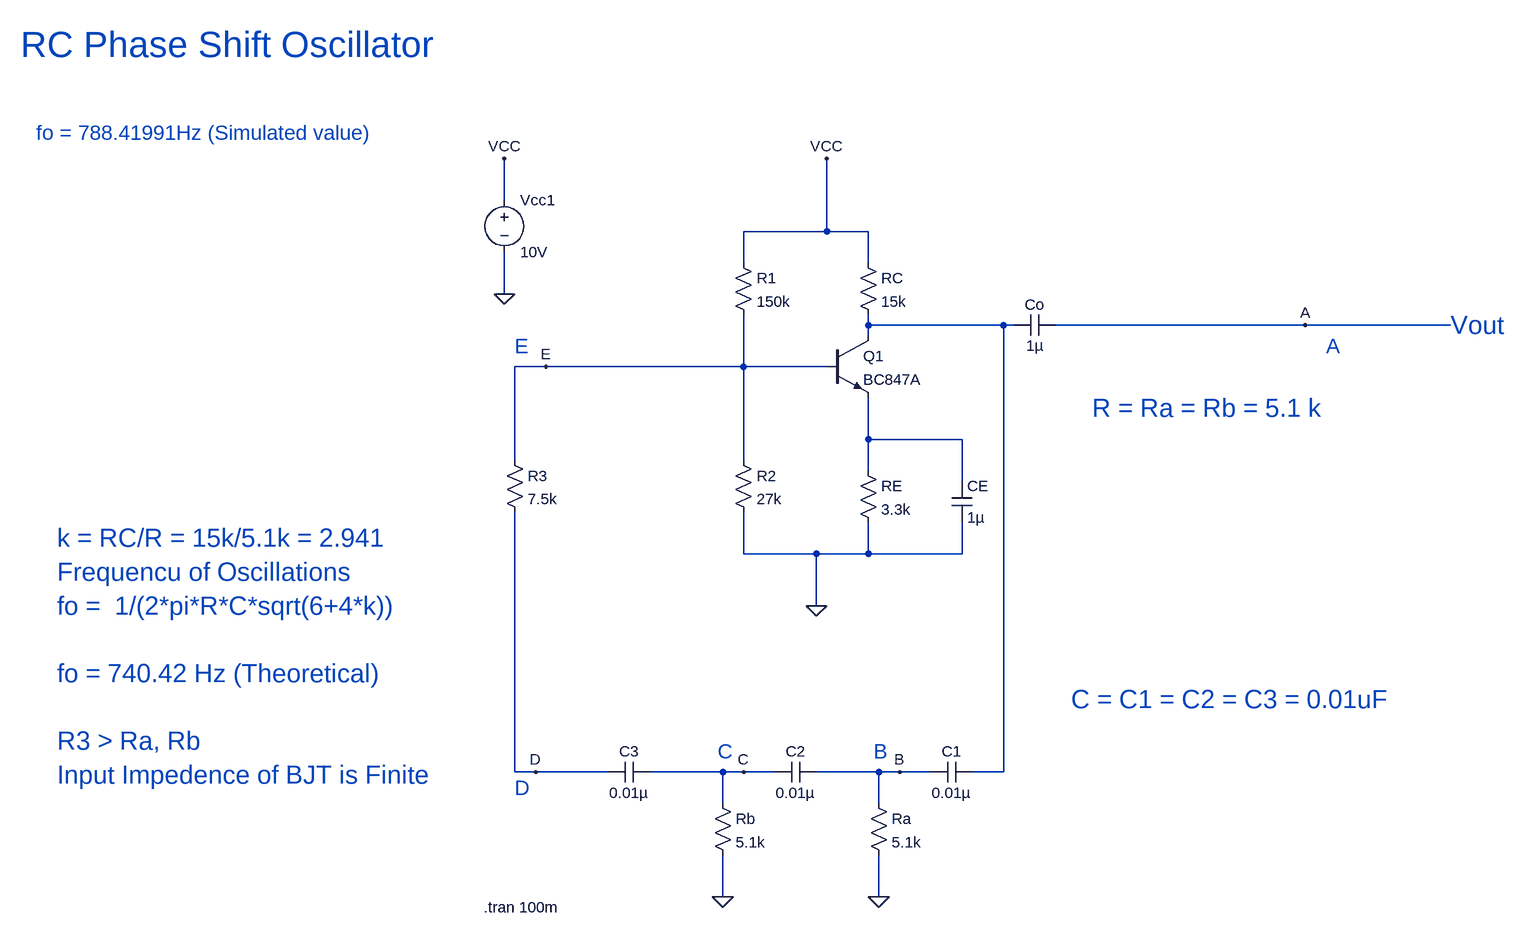
[diagram p0: schematic Phase_shift_Oscillator.asc]
Phase_shift_Oscillator.asc, the LTspice schematic file:
Version 4
SHEET 1 1012 740
WIRE -640 -368 -640 -432
WIRE -144 -320 -144 -432
WIRE -144 -320 -272 -320
WIRE -80 -320 -144 -320
WIRE -272 -272 -272 -320
WIRE -80 -272 -80 -320
WIRE -640 -224 -640 -288
WIRE -80 -176 -80 -192
WIRE 128 -176 -80 -176
WIRE 144 -176 128 -176
WIRE 592 -176 208 -176
WIRE 816 -176 592 -176
WIRE -80 -160 -80 -176
WIRE -576 -112 -624 -112
WIRE -272 -112 -272 -192
WIRE -272 -112 -576 -112
WIRE -144 -112 -272 -112
WIRE -80 0 -80 -64
WIRE 64 0 -80 0
WIRE -624 32 -624 -112
WIRE -272 32 -272 -112
WIRE -80 48 -80 0
WIRE 64 64 64 0
WIRE -272 176 -272 112
WIRE -160 176 -272 176
WIRE -80 176 -80 128
WIRE -80 176 -160 176
WIRE 64 176 64 128
WIRE 64 176 -80 176
WIRE -160 256 -160 176
WIRE -624 512 -624 112
WIRE -592 512 -624 512
WIRE -480 512 -592 512
WIRE -304 512 -416 512
WIRE -272 512 -304 512
WIRE -224 512 -272 512
WIRE -64 512 -160 512
WIRE -32 512 -64 512
WIRE 16 512 -32 512
WIRE 128 512 128 -176
WIRE 128 512 80 512
WIRE -304 560 -304 512
WIRE -64 560 -64 512
WIRE -304 704 -304 640
WIRE -64 704 -64 640
FLAG -640 -224 0
FLAG -144 -432 VCC
FLAG -640 -432 VCC
FLAG -304 704 0
FLAG -64 704 0
FLAG -160 256 0
FLAG -576 -112 E
FLAG -592 512 D
FLAG -32 512 B
FLAG 592 -176 A
FLAG -272 512 C
SYMBOL voltage -640 -384 R0
WINDOW 123 0 0 Left 0
WINDOW 39 0 0 Left 0
SYMATTR InstName Vcc1
SYMATTR Value 10V
SYMBOL res -288 -288 R0
SYMATTR InstName R1
SYMATTR Value 150k
SYMBOL res -288 16 R0
SYMATTR InstName R2
SYMATTR Value 27k
SYMBOL res -96 32 R0
SYMATTR InstName RE
SYMATTR Value 3.3k
SYMBOL cap 144 -160 R270
WINDOW 0 32 32 VTop 2
WINDOW 3 0 32 VBottom 2
SYMATTR InstName Co
SYMATTR Value 1µ
SYMBOL res -96 -288 R0
SYMATTR InstName RC
SYMATTR Value 15k
SYMBOL npn -144 -160 R0
SYMATTR InstName Q1
SYMATTR Value BC847A
SYMBOL res -640 16 R0
SYMATTR InstName R3
SYMATTR Value 7.5k
SYMBOL cap -416 496 R90
WINDOW 0 0 32 VBottom 2
WINDOW 3 32 32 VTop 2
SYMATTR InstName C3
SYMATTR Value 0.01µ
SYMBOL cap -160 496 R90
WINDOW 0 0 32 VBottom 2
WINDOW 3 32 32 VTop 2
SYMATTR InstName C2
SYMATTR Value 0.01µ
SYMBOL cap 80 496 R90
WINDOW 0 0 32 VBottom 2
WINDOW 3 32 32 VTop 2
SYMATTR InstName C1
SYMATTR Value 0.01µ
SYMBOL res -320 544 R0
SYMATTR InstName Rb
SYMATTR Value 5.1k
SYMBOL res -80 544 R0
SYMATTR InstName Ra
SYMATTR Value 5.1k
SYMBOL cap 48 64 R0
SYMATTR InstName CE
SYMATTR Value 1µ
TEXT 816 -176 Left 4 ;Vout
TEXT -672 720 Left 2 !.tran 100m
TEXT 624 -144 Left 3 ;A
TEXT -624 -144 Left 3 ;E
TEXT -624 536 Left 3 ;D
TEXT -312 480 Left 3 ;C
TEXT -72 480 Left 3 ;B
TEXT 264 -48 Left 4 ;R = Ra = Rb = 5.1 k
TEXT 232 400 Left 4 ;C = C1 = C2 = C3 = 0.01uF
TEXT -1328 152 Left 4 ;k = RC/R = 15k/5.1k = 2.941\nFrequencu of Oscillations\nfo =  1/(2*pi*R*C*sqrt(6+4*k))\n \nfo = 740.42 Hz (Theoretical)\n \nR3 > Ra, Rb\nInput Impedence of BJT is Finite
TEXT -1384 -608 Left 5 ;RC Phase Shift Oscillator
TEXT -1360 -472 Left 3 ;fo = 788.41991Hz (Simulated value)

The netlist it stands for:
* Phase_shift_Oscillator.asc
Vcc1 VCC 0 10V
R1 VCC E 150k
R2 E 0 27k
RE N002 0 3.3k
Co N001 A 1µ
RC VCC N001 15k
Q1 N001 E N002 0 BC847A
R3 E D 7.5k
C3 C D 0.01µ
C2 B C 0.01µ
C1 N001 B 0.01µ
Rb C 0 5.1k
Ra B 0 5.1k
CE N002 0 1µ
.model NPN NPN
.model PNP PNP
.lib standard.bjt
* Vout
.tran 100m
* A
* E
* D
* C
* B
* R = Ra = Rb = 5.1 k
* C = C1 = C2 = C3 = 0.01uF
* k = RC/R = 15k/5.1k = 2.941
* Frequencu of Oscillations
* fo =  1/(2*pi*R*C*sqrt(6+4*k))
* fo = 740.42 Hz (Theoretical)
* R3 > Ra, Rb
* Input Impedence of BJT is Finite
* RC Phase Shift Oscillator
* fo = 788.41991Hz (Simulated value)
.backanno
.end